# EAGLE schematic Comparadores (EAGLE 9.6.2)
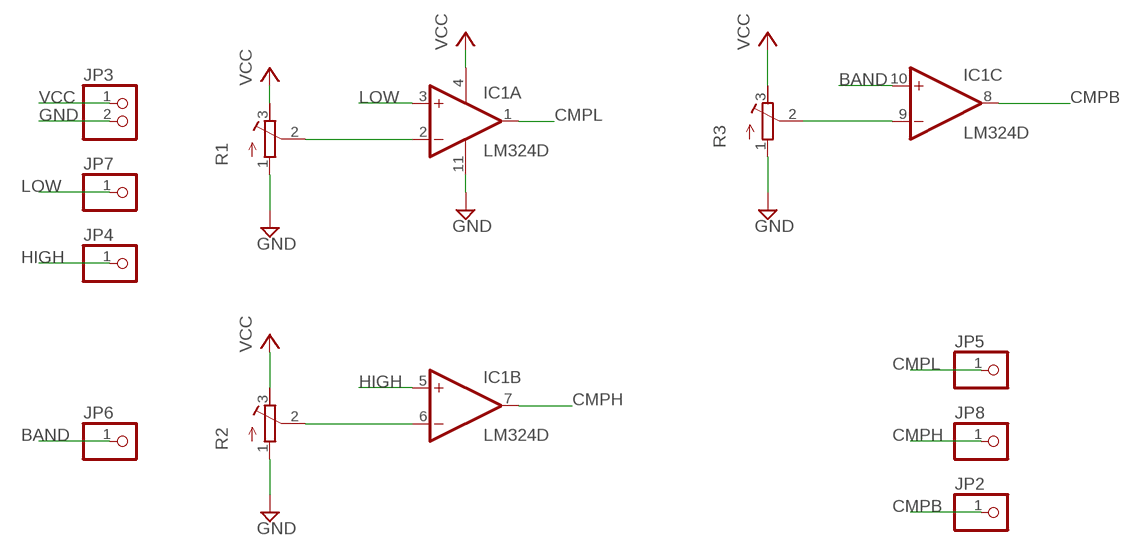
[diagram p0: schematic, sheet 1]

## Parts
IC1  LM324D  [SO14]
JP2  PINHD-1X1  [1X01]
JP3  PINHD-1X2  [1X02]
JP4  PINHD-1X1  [1X01]
JP5  PINHD-1X1  [1X01]
JP6  PINHD-1X1  [1X01]
JP7  PINHD-1X1  [1X01]
JP8  PINHD-1X1  [1X01]
R1  R-TRIMM64W  [RTRIM64W]
R2  R-TRIMM64W  [RTRIM64W]
R3  R-TRIMM64W  [RTRIM64W]

## Nets
BAND: IC1.10(C:+IN) JP6.1
CMPB: IC1.8(C:OUT) JP2.1
CMPH: IC1.7(B:OUT) JP8.1
CMPL: IC1.1(A:OUT) JP5.1
GND: IC1.11(P:V-) JP3.2 R1.1(A) R2.1(A) R3.1(A)
HIGH: IC1.5(B:+IN) JP4.1
LOW: IC1.3(A:+IN) JP7.1
N$1: IC1.2(A:-IN) R1.2(S)
N$3: IC1.6(B:-IN) R2.2(S)
N$16: IC1.9(C:-IN) R3.2(S)
VCC: IC1.4(P:V+) JP3.1 R1.3(E) R2.3(E) R3.3(E)
Unconnected: IC1.12(D:+IN) IC1.13(D:-IN) IC1.14(D:OUT)

## Library data of the parts
IC1 = linear:LM324: OP AMP
JP2 JP4-JP8 = pinhead:PINHD-1X1: PIN HEADER
JP3 = pinhead:PINHD-1X2: PIN HEADER
R1-R3 = rcl:R-TRIMM: Trimm resistor; SPICEMODEL: X; SPICEPREFIXL: POT